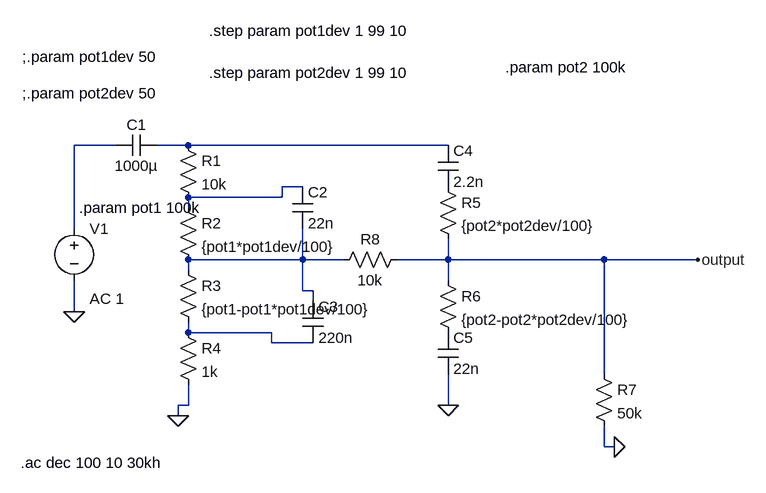
[diagram p0: schematic baxandall tone control circuit.asc]
baxandall tone control circuit.asc, the LTspice schematic file:
Version 4
SHEET 1 1120 680
WIRE 128 32 64 32
WIRE 240 32 192 32
WIRE 640 32 240 32
WIRE 416 96 384 96
WIRE 384 112 384 96
WIRE 384 112 240 112
WIRE 240 128 240 112
WIRE 64 160 64 32
WIRE 416 208 416 160
WIRE 416 208 240 208
WIRE 480 208 416 208
WIRE 640 208 640 176
WIRE 640 208 560 208
WIRE 880 208 640 208
WIRE 1024 208 880 208
WIRE 240 224 240 208
WIRE 640 240 640 208
WIRE 416 256 416 208
WIRE 432 256 416 256
WIRE 432 272 432 256
WIRE 64 288 64 240
WIRE 240 320 240 304
WIRE 368 320 240 320
WIRE 368 336 368 320
WIRE 432 336 368 336
WIRE 880 384 880 208
WIRE 240 432 240 400
WIRE 240 432 224 432
WIRE 640 432 640 384
WIRE 224 448 224 432
WIRE 880 496 880 464
WIRE 896 496 880 496
FLAG 64 288 0
FLAG 224 448 0
FLAG 640 432 0
FLAG 896 496 0
FLAG 1024 208 output
SYMBOL voltage 64 144 R0
WINDOW 123 24 124 Left 2
WINDOW 39 0 0 Left 0
SYMATTR InstName V1
SYMATTR Value ""
SYMATTR Value2 AC 1
SYMBOL cap 192 16 R90
WINDOW 0 0 32 VBottom 2
WINDOW 3 32 32 VTop 2
SYMATTR InstName C1
SYMATTR Value 1000µ
SYMBOL res 224 16 R0
SYMATTR InstName R1
SYMATTR Value 10k
SYMBOL res 224 112 R0
SYMATTR InstName R2
SYMATTR Value {pot1*pot1dev/100}
SYMBOL res 224 208 R0
SYMATTR InstName R3
SYMATTR Value {pot1-pot1*pot1dev/100}
SYMBOL res 224 304 R0
SYMATTR InstName R4
SYMATTR Value 1k
SYMBOL cap 400 96 R0
SYMATTR InstName C2
SYMATTR Value 22n
SYMBOL cap 416 272 R0
SYMATTR InstName C3
SYMATTR Value 220n
SYMBOL cap 624 32 R0
SYMATTR InstName C4
SYMATTR Value 2.2n
SYMBOL res 624 80 R0
SYMATTR InstName R5
SYMATTR Value {pot2*pot2dev/100}
SYMBOL res 624 224 R0
SYMATTR InstName R6
SYMATTR Value {pot2-pot2*pot2dev/100}
SYMBOL res 864 368 R0
SYMATTR InstName R7
SYMATTR Value 50k
SYMBOL cap 624 320 R0
SYMATTR InstName C5
SYMATTR Value 22n
SYMBOL res 576 192 R90
WINDOW 0 0 56 VBottom 2
WINDOW 3 32 56 VTop 2
SYMATTR InstName R8
SYMATTR Value 10k
TEXT 72 128 Left 2 !.param pot1 100k
TEXT -16 -104 Left 2 !;.param pot1dev 50
TEXT 728 -88 Left 2 !.param pot2 100k
TEXT -16 -48 Left 2 !;.param pot2dev 50
TEXT -18 520 Left 2 !.ac dec 100 10 30kh
TEXT 272 -144 Left 2 !.step param pot1dev 1 99 10
TEXT 272 -80 Left 2 !.step param pot2dev 1 99 10

The netlist it stands for:
* baxandall tone control circuit.asc
V1 N001 0 AC 1
C1 N002 N001 1000µ
R1 N002 N003 10k
R2 N003 N004 {pot1*pot1dev/100}
R3 N004 N005 {pot1-pot1*pot1dev/100}
R4 N005 0 1k
C2 N003 N004 22n
C3 N004 N005 220n
C4 N002 P001 2.2n
R5 P001 output {pot2*pot2dev/100}
R6 output P002 {pot2-pot2*pot2dev/100}
R7 output 0 50k
C5 P002 0 22n
R8 output N004 10k
.param pot1 100k
;.param pot1dev 50
.param pot2 100k
;.param pot2dev 50
.ac dec 100 10 30kh
.step param pot1dev 1 99 10
.step param pot2dev 1 99 10
.backanno
.end